# EAGLE design telemetry-b1 (EAGLE 7.6.0)
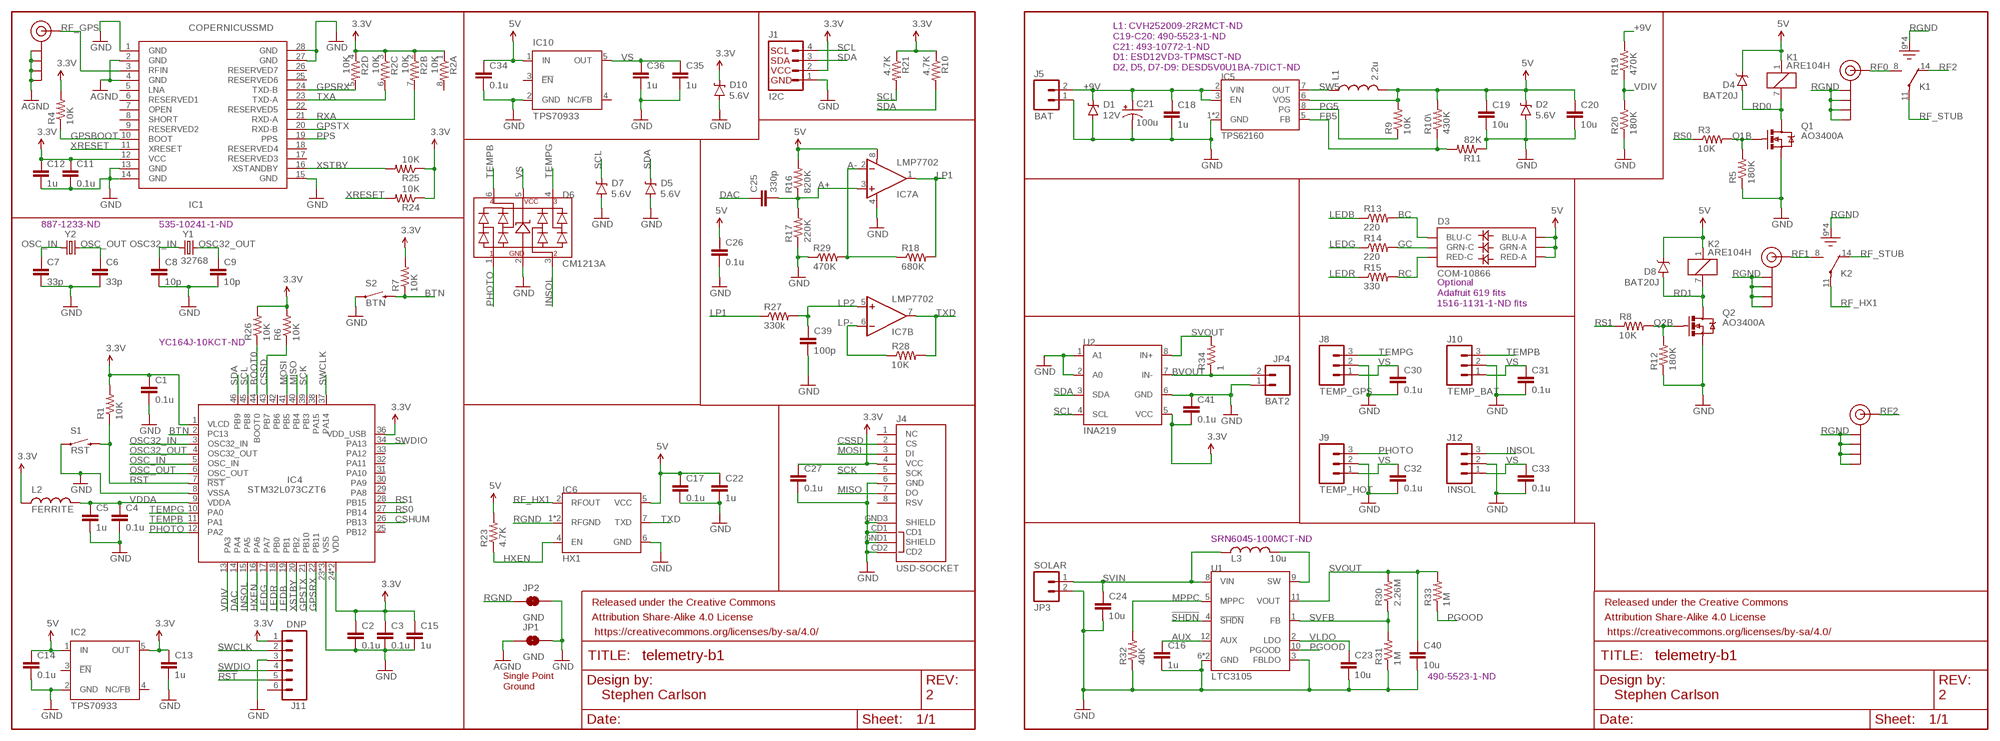
[diagram p0: schematic, sheet 1]

## Parts
C1  0.1u  CAP0805  [0805]
C2  0.1u  CAP0805  [0805]
C3  0.1u  CAP0805  [0805]
C4  0.1u  CAP0805  [0805]
C5  1u  CAP0805  [0805]
C6  33p  CAP0805  [0805]
C7  33p  CAP0805  [0805]
C8  10p  CAP0805  [0805]
C9  10p  CAP0805  [0805]
C11  0.1u  CAP0805  [0805]
C12  1u  CAP0805  [0805]
C13  1u  CAP0805  [0805]
C14  0.1u  CAP0805  [0805]
C15  1u  CAP0805  [0805]
C16  1u  CAP0805  [0805]
C17  0.1u  CAP0805  [0805]
C18  1u  CAP0805  [0805]
C19  10u  CAP0805  [0805]
C20  10u  CAP0805  [0805]
C21  100u  CAP_POLPTH2  [CPOL-RADIAL-10UF-25V]
C22  1u  CAP0805  [0805]
C23  10u  CAP0805  [0805]
C24  10u  CAP0805  [0805]
C25  330p  CAP0805  [0805]
C26  0.1u  CAP0805  [0805]
C27  0.1u  CAP0805  [0805]
C30  0.1u  CAP0805  [0805]
C31  0.1u  CAP0805  [0805]
C32  0.1u  CAP0805  [0805]
C33  0.1u  CAP0805  [0805]
C34  0.1u  CAP0805  [0805]
C35  1u  CAP0805  [0805]
C36  1u  CAP0805  [0805]
C39  100p  CAP0805  [0805]
C40  10u  CAP0805  [0805]
C41  0.1u  CAP0805  [0805]
D1  12V  DIODE-ZENER5.6V  [SOD-323]
D2  5.6V  DIODE-ZENER5.6V  [SOD-323]
D3  COM-10866  LED-TRICOLOR-5050NO_IC  [LED-TRICOLOR-5050]
D4  BAT20J  DIODE-SCHOTTKY-BAT20J  [SOD-323]
D5  5.6V  DIODE-ZENER5.6V  [SOD-323]
D6  CM1213A  [SC70-6L]
D7  5.6V  DIODE-ZENER5.6V  [SOD-323]
D8  BAT20J  DIODE-SCHOTTKY-BAT20J  [SOD-323]
D10  5.6V  DIODE-ZENER5.6V  [SOD-323]
FRAME1  FRAME-LETTERNO_PACKAGE  [DUMMY]
FRAME2  FRAME-LETTERNO_PACKAGE  [DUMMY]
IC1  COPERNICUSSMD  [COPERNICUS]
IC2  TPS70933  TPS77033  [SOT23-DBV]
IC4  STM32L073CZT6  STM32L07C  [TQFP48]
IC5  TPS62160  [MSOP8]
IC6  HX1  [HX1]
IC7  LMP7702  OPAMP-DUALU  [SO08]
IC10  TPS70933  TPS77033  [SOT23-DBV]
J1  I2C  I2C_STANDARD_NO_SILK  [1X04_NO_SILK]
J3  SMA_EDGE  [SMA-EDGE]
J4  USD-SOCKET  [MICROSD_1:1]
J5  BAT  M02PTH  [1X02]
J6  SMA_EDGE  [SMA-EDGE]
J7  SMA_EDGE  [SMA-EDGE]
J8  TEMP_GPS  M03JST-PTH  [JST-3-PTH]
J9  TEMP_HOT  M03JST-PTH  [JST-3-PTH]
J10  TEMP_BAT  M03JST-PTH  [JST-3-PTH]
J11  DNP  M06LOCK  [1X06_LOCK]
J12  INSOL  M03JST-PTH  [JST-3-PTH]
J13  SMA_EDGE  [SMA-EDGE]
JP1  GND  JUMPER-PAD-2-NC_BY_TRACE  [PAD-JUMPER-2-NC_BY_TRACE_YES_SILK]
JP2  GND  JUMPER-PAD-2-NC_BY_TRACE  [PAD-JUMPER-2-NC_BY_TRACE_YES_SILK]
JP3  SOLAR  M02PTH  [1X02]
JP4  BAT2  M02PTH  [1X02]
K1  ARE104H  RF_RELAY  [RFDIL14]
K2  ARE104H  RF_RELAY  [RFDIL14]
L1  2.2u  INDUCTOR1008  [1008]
L2  FERRITE  INDUCTOR1206  [1206]
L3  10u  INDUCTORBOURNS_SRN6045  [SRN6045]
Q1  AO3400A  MOSFET-NCHANNELAO3404A  [SOT23-3]
Q2  AO3400A  MOSFET-NCHANNELAO3404A  [SOT23-3]
R1  10K  RESISTOR0805-RES  [0805]
R2  10K  RESISTOR-ARRAY0603-ARV  [0603-ARV]
R3  10K  RESISTOR0805-RES  [0805]
R4  10K  RESISTOR0805-RES  [0805]
R5  180K  RESISTOR0805-RES  [0805]
R6  10K  RESISTOR0805-RES  [0805]
R7  10K  RESISTOR0805-RES  [0805]
R8  10K  RESISTOR0805-RES  [0805]
R9  10K  RESISTOR0805-RES  [0805]
R10  4.7K  RESISTOR0805-RES  [0805]
R10\  430K  RESISTOR0805-RES  [0805]
R11  82K  RESISTOR0805-RES  [0805]
R12  180K  RESISTOR0805-RES  [0805]
R13  220  RESISTOR0805-RES  [0805]
R14  220  RESISTOR0805-RES  [0805]
R15  330  RESISTOR0805-RES  [0805]
R16  820K  RESISTOR0805-RES  [0805]
R17  220K  RESISTOR0805-RES  [0805]
R18  680K  RESISTOR0805-RES  [0805]
R19  470K  RESISTOR0805-RES  [0805]
R20  180K  RESISTOR0805-RES  [0805]
R21  4.7K  RESISTOR0805-RES  [0805]
R23  4.7K  RESISTOR0805-RES  [0805]
R24  10K  RESISTOR0805-RES  [0805]
R25  10K  RESISTOR0805-RES  [0805]
R26  10K  RESISTOR0805-RES  [0805]
R27  330k  RESISTOR0805-RES  [0805]
R28  10K  RESISTOR0805-RES  [0805]
R29  470K  RESISTOR0805-RES  [0805]
R30  2.26M  RESISTOR0805-RES  [0805]
R31  1M  RESISTOR0805-RES  [0805]
R32  40K  RESISTOR0805-RES  [0805]
R33  1M  RESISTOR0805-RES  [0805]
R34  1  RESISTOR0805-RES  [0805]
S1  RST  SWITCH  [TACTILE-PTH-THIN]
S2  BTN  SWITCH  [TACTILE-PTH-THIN]
U1  LTC3105  [MSOP12]
U2  INA219  [SO8]
Y1  32768  CRYSTAL  [ABS25]
Y2  8M  CRYSTALSMD  [HC49UP]

## Nets
3.3V: C1.1 C2.1 C3.1 C11.1 C12.1 C13.1 C15.1 C27.1 C41.2 D10.C IC1.12(VCC) IC2.5(OUT) IC4.1(VLCD) IC4.24(VDD) IC4.36(VDD_USB) IC4.48(VDD) J1.2 J4.4(VCC) J11.1 L2.1 R1.2 R2.1 R2.2 R2.3 R2.4 R4.2 R6.2 R7.2 R10.1 R21.1 R24.1 R25.1 R26.2 U2.5(VCC)
5V: C14.1 C17.1 C19.1 C20.1 C22.1 C26.1 C34.1 D2.C D3.1(GRN-A) D3.2(RED-A) D3.3(BLU-A) D4.C D8.C IC2.1(IN) IC5.6(VOS) IC6.5(VCC) IC7.8(A:V+) IC10.1(IN) K1.1 K2.1 L1.2 R9.2 R10\.2 R16.2 R23.2
!RST!: IC4.7(!RST!) J11.5 R1.1 S1.2
!SHDN!: U1.4(!SHDN!)
+9V: C18.1 C21.1(+) D1.C IC5.2(VIN) IC5.3(EN) J5.2 R19.2
A+: C25.2 IC7.3(A:+IN) R16.1 R17.2
A-: IC7.2(A:-IN) R18.1 R29.2
AGND: IC1.2(GND) IC1.4(GND) J7.GND@0(GND) J7.GND@1(GND) J7.GND@2(GND) J7.GND@3(GND) JP1.1
AUX: C16.1 U1.12(AUX)
BC: D3.4(BLU-C) R13.2
BOOT0: IC4.44(BOOT0) R26.1
BTN: IC4.2(PC13) R7.1 S2.2
BVOUT: JP4.2 R34.1 U2.7(IN-)
CSHUM: IC4.26(PB13)
CSSD: IC4.43(PB7) J4.2(CS) R6.1
DAC: C25.1 IC4.14(PA4)
FB5: IC5.5(FB) R10\.1 R11.2
GC: D3.6(GRN-C) R14.2
GND: C1.2 C2.2 C3.2 C4.2 C5.2 C6.2 C7.2 C8.2 C9.2 C11.2 C12.2 C13.2 C14.2 C15.2 C16.2 C17.2 C18.2 C19.2 C20.2 C21.2(-) C22.2 C23.2 C24.2 C26.2 C27.2 C30.2 C31.2 C32.2 C33.2 C34.2 C35.2 C36.2 C39.2 C40.2 C41.1 D1.A D2.A D5.A D6.2(GND) D7.A D10.A IC1.1(GND) IC1.13(GND) IC1.14(GND) IC1.15(GND) IC1.27(GND) IC1.28(GND) IC2.2(GND) IC4.8(VSSA) IC4.23(VSS) IC4.35(VSS) IC4.47(VSS) IC5.1(GND) IC5.4(GND) IC6.6(GND) IC7.4(A:V-) IC10.2(GND) J1.1 J4.6(GND) J4.CD1 J4.CD2 J4.GND1(SHIELD) J4.GND3(SHIELD) J5.1 J8.2 J9.2 J10.2 J11.3 J12.2 JP1.2 JP2.2 JP3.2 JP4.1 Q1.2(S) Q2.2(S) R5.1 R11.1 R12.1 R17.1 R20.1 R29.1 R31.1 R32.1 S1.1 S2.1 U1.3(FBLDO) U1.6(GND) U1.7(GND) U2.1(A1) U2.2(A0) U2.6(GND)
GPSBOOT: IC1.10(BOOT) R4.1
GPSRX: IC1.24(TXD-B) IC4.22(PB11) R2.5
GPSTX: IC1.20(RXD-B) IC4.21(PB10)
HXEN: IC4.16(PA6) IC6.4(EN) R23.1
INSOL: D6.3(CH2) IC4.15(PA5) J12.3
LEDB: IC4.19(PB1) R13.1
LEDG: IC4.17(PA7) R14.1
LEDR: IC4.18(PB0) R15.1
LP1: IC7.1(A:OUT) R18.2 R27.1
LP2: C39.1 IC7.5(B:+IN) R27.2
LP-: IC7.6(B:-IN) R28.1
MISO: IC4.40(PB4) J4.7(DO)
MOSI: IC4.41(PB5) J4.3(DI)
MPPC: R32.2 U1.5(MPPC)
OSC32_IN: C8.1 IC4.3(OSC32_IN) Y1.1
OSC32_OUT: C9.1 IC4.4(OSC32_OUT) Y1.4
OSC_IN: C7.1 IC4.5(OSC_IN) Y2.1
OSC_OUT: C6.1 IC4.6(OSC_OUT) Y2.2
PG5: IC5.8(PG) R9.1
PGOOD: R33.1 U1.10(PGOOD)
PHOTO: D6.1(CH1) IC4.12(PA2) J9.3
PPS: IC1.19(PPS)
Q1B: Q1.1(G) R3.2 R5.2
Q2B: Q2.1(G) R8.2 R12.2
RC: D3.5(RED-C) R15.2
RD0: D4.A K1.7 Q1.3(D)
RD1: D8.A K2.7 Q2.3(D)
RF0: J6.SIG(SIGNAL) K1.8(S)
RF1: J3.SIG(SIGNAL) K2.8(S)
RF2: J13.SIG(SIGNAL) K1.14(O)
RF_GPS: IC1.3(RFIN) J7.SIG(SIGNAL)
RF_HX1: IC6.2(RFOUT) K2.11(P)
RF_STUB: K1.11(P) K2.14(O)
RGND: IC6.1(RFGND) IC6.3(RFGND) J3.GND@0(GND) J3.GND@1(GND) J3.GND@2(GND) J3.GND@3(GND) J6.GND@0(GND) J6.GND@1(GND) J6.GND@2(GND) J6.GND@3(GND) J13.GND@0(GND) J13.GND@1(GND) J13.GND@2(GND) J13.GND@3(GND) JP2.1 K1.9(GND) K1.10(GND) K1.12(GND) K1.13(GND) K2.9(GND) K2.10(GND) K2.12(GND) K2.13(GND)
RS0: IC4.27(PB14) R3.1
RS1: IC4.28(PB15) R8.1
RXA: IC1.21(RXD-A) R2.7
SCK: IC4.39(PB3) J4.5(SCK)
SCL: D7.C IC4.45(PB8) J1.4 R21.2 U2.4(SCL)
SDA: D5.C IC4.46(PB9) J1.3 R10.2 U2.3(SDA)
SVFB: R30.1 R31.2 U1.1(FB)
SVIN: C24.1 JP3.1 L3.1 U1.8(VIN)
SVOUT: C40.1 R30.2 R33.2 R34.2 U1.11(VOUT) U2.8(IN+)
SW: L3.2 U1.9(SW)
SW5: IC5.7(OUT) L1.1
SWCLK: IC4.37(PA14) J11.2
SWDIO: IC4.34(PA13) J11.4
TEMPB: D6.6(CH4) IC4.11(PA1) J10.3
TEMPG: D6.4(CH3) IC4.10(PA0) J8.3
TXA: IC1.23(TXD-A) R2.6
TXD: IC6.7(TXD) IC7.7(B:OUT) R28.2
VDDA: C4.1 C5.1 IC4.9(VDDA) L2.2
VDIV: IC4.13(PA3) R19.1 R20.2
VLDO: C23.1 U1.2(LDO)
VS: C30.1 C31.1 C32.1 C33.1 C35.1 C36.1 D6.5(VCC) IC10.5(OUT) J8.1 J9.1 J10.1 J12.1
XRESET: IC1.11(XRESET) R24.2
XSTBY: IC1.16(XSTANDBY) IC4.20(PB2) R25.2
Unconnected: IC1.5(LNA) IC1.6(RESERVED1) IC1.7(OPEN) IC1.8(SHORT) IC1.9(RESERVED2) IC1.17(RESERVED3) IC1.18(RESERVED4) IC1.22(RESERVED5) IC1.25(RESERVED6) IC1.26(RESERVED7) IC2.3(!EN) IC2.4(NC/FB) IC4.25(PB12) IC4.29(PA8) IC4.30(PA9) IC4.31(PA10) IC4.32(PA11) IC4.33(PA12) IC4.38(PA15) IC4.42(PB6) IC10.3(!EN) IC10.4(NC/FB) J4.1(NC) J4.8(RSV) J11.6 R2.8

## Notes on the sheet
- L1: CVH252009-2R2MCT-ND
  C19-C20: 490-5523-1-ND
  C21: 493-10772-1-ND
  D1: ESD12VD3-TPMSCT-ND
  D2, D5, D7-D9: DESD5V0U1BA-7DICT-ND
- 887-1233-ND | 535-10241-1-ND
- Optional
  Adafruit 619 fits
  1516-1131-1-ND fits
- YC164J-10KCT-ND
- SRN6045-100MCT-ND
- 490-5523-1-ND
- Single Point
  Ground
- Stephen Carlson | 2 | Stephen Carlson | 2

## Library data of the parts
C1-C9 C11-C20 C22-C27 C30-C36 C39-C41 = SparkFun-Passives:CAP: Capacitor Standard 0603 ceramic capacitor, and 0.1" leaded capacitor.
C21 = SparkFun-Passives:CAP_POL: Capacitor Polarized These are standard SMD and PTH capacitors. Normally 10uF, 47uF, and 100uF in electrolytic and tantalum varieties. Always verify the external diameter of the through hole cap, it varies with capacity, voltage, and manufacturer. The EIA devices should be standard.
D1 = SparkFun-DiscreteSemi:DIODE-ZENER: Zener Diode Production Part - 8199 3.4V Zener Voltage; PROD_ID: DIO-12442; VALUE: 5.6V
D2 D5 D7 D10 = SparkFun-DiscreteSemi:DIODE-ZENER: Zener Diode Production Part - 8199 3.4V Zener Voltage; PROD_ID: DIO-12442
D3 = SparkFun-LED:LED-TRICOLOR-5050
D4 D8 = SparkFun-DiscreteSemi:DIODE-SCHOTTKY: Schottky diodes in SFE's production catalog BAT20J 1A 23V 0.62Vf RB751 120mA 40V 0.37Vf PMEG4005EJ 0.5A 40V 0.42Vf MBRA140 1A 40V 0.5Vf B340A 3A 40V SMA; PROD_ID: DIO-11623
D6 = HAB:CM1213A: CM1213A CM1213A 4-channel ESD protection device
FRAME1 FRAME2 = SparkFun-Aesthetics:FRAME-LETTER: Schematic Frame Standard 8.5x11 US Letter frame; DESIGNER: Nobody; VERSION: v01
IC1 = SparkFun-RF:COPERNICUS: Copernicus II GPS- Trimble recommended layout and paste layer. Footprint production proven. Spark Fun Electronics SKU : GPS-07951
IC2 IC10 = texas:TPS770*: ULTRALOW-POWER 50-mA LOW-DROPOUT LINEAR REGULATORS 50-mA Low-Dropout Regulator Source: http://focus.ti.com/lit/ds/symlink/tps77001.pdf; MF: TEXAS INSTRUMENTS; MPN: TPS77033DBVT; OC_FARNELL: 8461570; OC_NEWARK: 77C1187
IC4 = stm32xx:STM32L07*C: STM32L07XC STM32L07X series in LQFP-48 package
IC5 = HAB:TPS62160: TPS62160 Adjustable switch-mode D-CAP2 regulator
IC6 = HAB:HX1: Radiometrix HX1 High-power VHF Narrow Band 300 mW Transmitter
IC7 = SparkFun-AnalogIC:OPAMP-DUAL: Generic op-amp footprint
J1 = SparkFun-Connectors:I2C_STANDARD: SparkFun has standardized on a pinout for all I2C based sensor breakouts. This pinout allows I2C boards to be plugged directly into the headers on Arduino Uno compatible boards, and to be daisy chained easily.
J3 J6 J7 J13 = SparkFun-Connectors:SMA_EDGE: SMA Antenna Connector End launch SMA connector. The paste layer has been removed so that the connector can be hand soldered onto the board after reflow.
J4 = SparkFun-Connectors:USD-SOCKET: microSD Socket Push-push type uSD socket. Schematic element and footprint production proven. Spark Fun Electronics SKU : PRT-00127. tDoc lines correctly indicate media card edge positions when inserting (unlocked, locked, depressed). NOTE: CD1 and CD2 are connected internally; PROD_ID: CONN-07820
J5 JP3 JP4 = SparkFun-Connectors:M02: Standard 2-pin 0.1" header. Use with - straight break away headers ( PRT-00116) - right angle break away headers (PRT-00553) - swiss pins (PRT-00743) - machine pins (PRT-00117) - female headers (PRT-00115) Molex polarized connector foot print use with: PRT-08233 with associated crimp pins and housings. 2.54_SCREWTERM for use with PRT-10571. 3.5mm Screw Terminal footprints for PRT-08084 5mm Screw Terminal footprints for use with PRT-08432
J8-J10 J12 = SparkFun-Connectors:M03: Header 3 Standard 3-pin 0.1" header. Use with straight break away headers (SKU : PRT-00116), right angle break away headers (PRT-00553), swiss pins (PRT-00743), machine pins (PRT-00117), and female headers (PRT-00115). Molex polarized connector foot print use with SKU : PRT-08232 with associated crimp pins and housings.; SKU: PRT-09915
J11 = SparkFun-Connectors:M06: Header 6 Standard 6-pin 0.1" header. Use with straight break away headers (SKU : PRT-00116), right angle break away headers (PRT-00553), swiss pins (PRT-00743), machine pins (PRT-00117), and female headers (PRT-00115). Molex polarized connector foot print use with SKU : PRT-08094 with associated crimp pins and housings. NOTES ON THE VARIANTS LOCK and LOCK_LONGPADS... This footprint was designed to help hold the alignment of a through-hole component (i.e. 6-pin header) while soldering it into place. You may notice that each hole has been shifted either up or down by 0.005 of an inch from it's more standard position (which is a perfectly straight line). This slight alteration caused the pins (the squares in the middle) to touch the edges of the holes. Because they are alternating, it causes a "brace" to hold the component in place. 0.005 has proven to be the perfect amount of "off-center" position when using our standard breakaway headers. Although looks a little odd when you look at the bare footprint, once you have a header in there, the alteration is very hard to notice. Also,if you push a header all the way into place, it is covered up entirely on the bottom side. This idea of altering the position of holes to aid alignment will be further integrated into the Sparkfun Library for other footprints. It can help hold any component with 3 or more connection pins.
JP1 JP2 = SparkFun-Passives:JUMPER-PAD-2-NC_BY_TRACE
K1 K2 = HAB:RF_RELAY: RF Relay RF Relay, Panasonic ARE10xx/ARE13xx series
L1 L2 = HAB:INDUCTOR: INDUCTOR Standard inductor, with some new packages Why do inductors never come in standard packages!?
L3 = SparkFun-Passives:INDUCTOR: Inductors Basic Inductor/Choke - 0603 and 1206. Footprints are not proven and vary greatly between part numbers. INDUCTOR POWER 3.3UH 4.0A SMD 0.197" L x 0.197" W x 0.177" H (5.00mm x 5.00mm x 4.50mm); PROD_ID: NDUC-11627; VALUE: 33uH
Q1 Q2 = SparkFun-DiscreteSemi:MOSFET-NCHANNEL: Common NMOSFET Parts MFG P/N Store ID Prod ID FDD8780 TRANS-09984 SI7820DN TRANS-11055 FDS6630A IC-08089 2N7002PW TRANS-11151 FQP30N06L COM-10213 TRANS-10060 BSS123LT1G TRANS-08345 BSS138 TRANS-00830 BS170 2N7000; PROD_ID: TRAN-12988
R1 R3-R10 R10\ R11-R21 R23-R34 = SparkFun-Passives:RESISTOR: Resistor Basic schematic elements and footprints for 0603, 1206, and PTH resistors.
R2 = SparkFun-Passives:RESISTOR-ARRAY: Array Chip Resistor Source: RS Component / Phycomp
S1 S2 = HAB:SWITCH: SWITCH Package for the MJTP1250, a thinner and lighter PTH push button switch.
U1 = LTC3105:LTC3105: LTC3105 400mA Step-Up DC/DC Converter with Maximum Power Point Control and 250mV Start-Up
U2 = HAB:INA219: INA219 26-V, Bi-Directional, Zero-Drift, High-Side, I2C Out Current/Power Monitor
Y1 = HAB:CRYSTAL: CRYSTAL Crystal oscillators in packages not in SparkFun-FreqCtl
Y2 = SparkFun-FreqCtrl:CRYSTAL: Various standard crystals. Proven footprints.

## Board
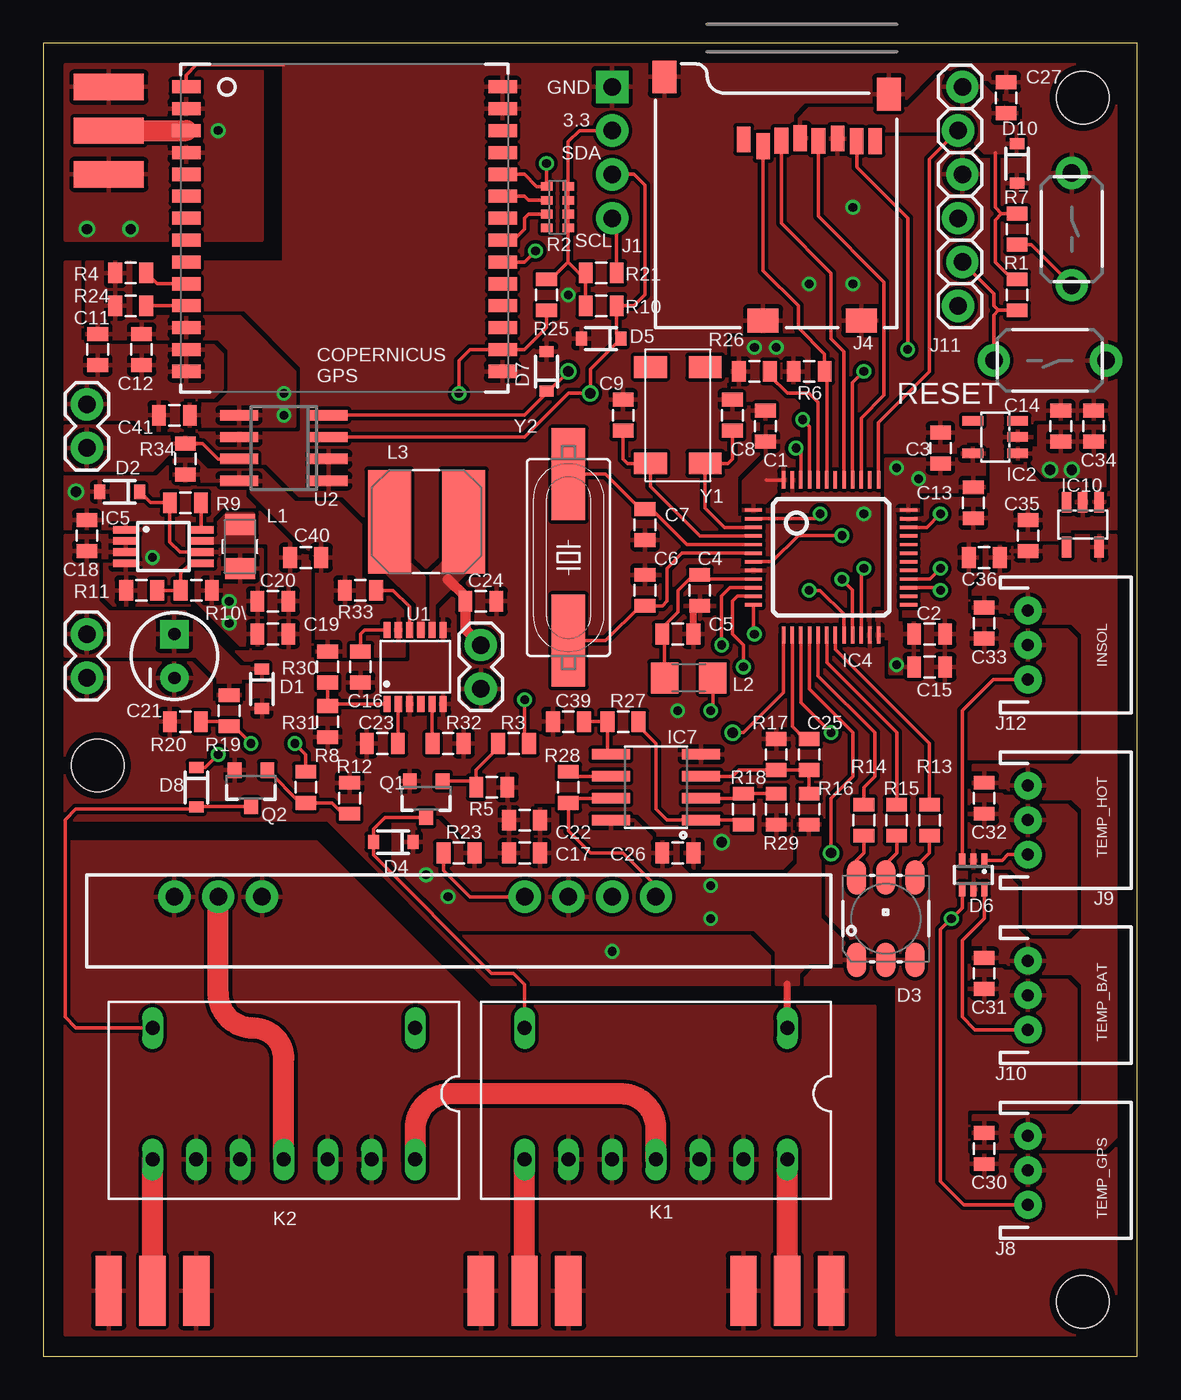
[diagram p1: board, top side]
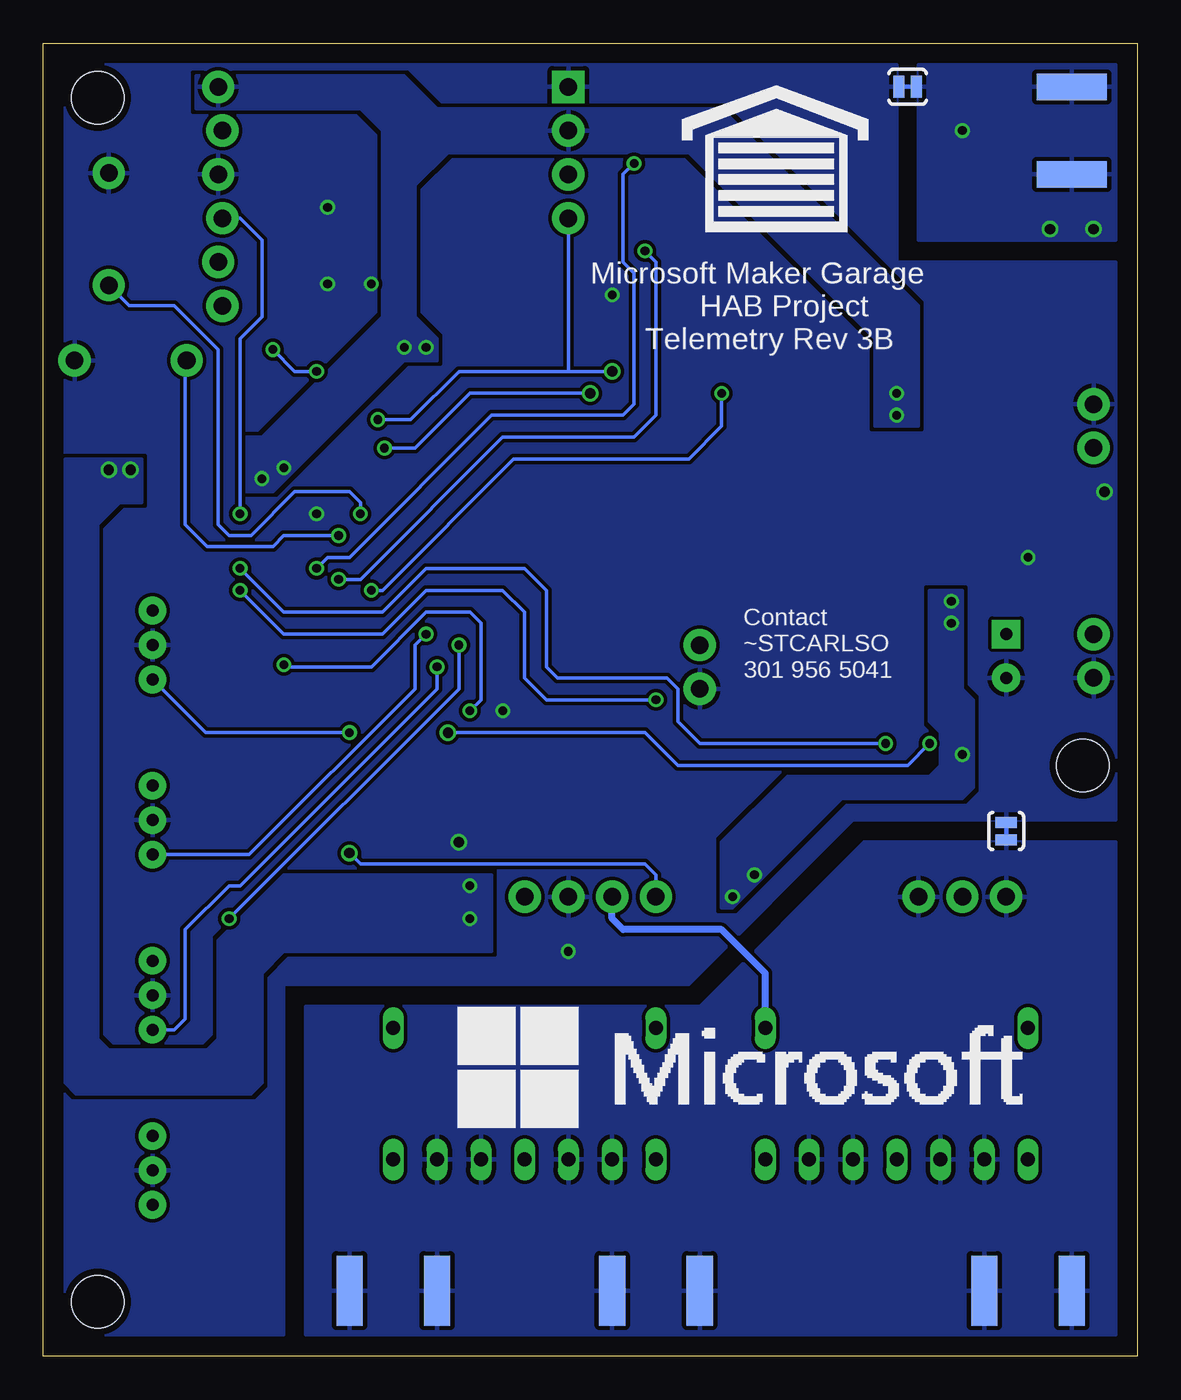
[diagram p2: board, bottom side, seen from below]

Size 63.5 x 76.2 mm. Coordinates in mm from the lower left corner, seen from the top.
Outline: 0,0 63.5,0 63.5,76.2 0,76.2 0,0
Copper layers (1*16): Top 0.0356mm / dielectric 1.5011mm / Bottom 0.0356mm
Design rules "LaenPCBOrder *": minimum track width 6mil, minimum drill 13mil, track to track 6mil, track to pad 6mil, pad to pad 6mil, via to via 6mil, smd to smd 6mil, copper to edge 15mil, drill to drill 6mil, minimum pad ring 7mil, minimum via ring 7mil, stop-mask expansion 3mil, vias tented up to drill 0mil, thermal gap 10mil
Holes 3.05 mm at 60.33,3.17 60.33,73.03 3.17,34.29

### Footprints (pad centres in the part's own frame; a part is rotated, then mirrored left to right if it is on the bottom)
0805 = smd 0.8 x 1.2: 1 -0.9,0; 2 0.9,0
CPOL-RADIAL-10UF-25V = drill 0.7 pad 1.651 square: 1 1.27,0 | drill 0.7 pad 1.651: 2 -1.27,0
SOD-323 = smd 0.63 x 0.83: A 1.15,0; C -1.15,0
LED-TRICOLOR-5050 = smd 2 x 1.1: 1 -2.4,1.7; 2 -2.4,0; 3 -2.4,-1.7; 4 2.4,-1.7; 5 2.4,0; 6 2.4,1.7
SC70-6L = smd 0.35 x 0.8: 1 -0.65,-0.85; 2 0,-0.85; 3 0.65,-0.85; 4 0.65,0.85; 5 0,0.85; 6 -0.65,0.85
COPERNICUS = smd 0.762 x 1.651: 1 0,-18.364; 2 1.27,-18.364; 3 2.54,-18.364; 4 3.81,-18.364; 5 5.08,-18.364; 6 6.35,-18.364; 7 7.62,-18.364; 8 8.89,-18.364; 9 10.16,-18.364; 10 11.43,-18.364; 11 12.7,-18.364; 12 13.97,-18.364; 13 15.24,-18.364; 14 16.51,-18.364; 15 16.51,0; 16 15.24,0; 17 13.97,0; 18 12.7,0; 19 11.43,0; 20 10.16,0; 21 8.89,0; 22 7.62,0; 23 6.35,0; 24 5.08,0; 25 3.81,0; 26 2.54,0; 27 1.27,0; 28 0,0
SOT23-DBV = smd 0.55 x 1.2: 1 -0.95,-1.3; 2 0,-1.3; 3 0.95,-1.3; 4 0.95,1.3; 5 -0.95,1.3
TQFP48 = smd 0.2 x 1: 1 -2.75,-4.5; 2 -2.25,-4.5; 3 -1.75,-4.5; 4 -1.25,-4.5; 5 -0.75,-4.5; 6 -0.25,-4.5; 7 0.25,-4.5; 8 0.75,-4.5; 9 1.25,-4.5; 10 1.75,-4.5; 11 2.25,-4.5; 12 2.75,-4.5; 25 2.75,4.5; 26 2.25,4.5; 27 1.75,4.5; 28 1.25,4.5; 29 0.75,4.5; 30 0.25,4.5; 31 -0.25,4.5; 32 -0.75,4.5; 33 -1.25,4.5; 34 -1.75,4.5; 35 -2.25,4.5; 36 -2.75,4.5 | smd 1 x 0.2: 13 4.5,-2.75; 14 4.5,-2.25; 15 4.5,-1.75; 16 4.5,-1.25; 17 4.5,-0.75; 18 4.5,-0.25; 19 4.5,0.25; 20 4.5,0.75; 21 4.5,1.25; 22 4.5,1.75; 23 4.5,2.25; 24 4.5,2.75; 37 -4.5,2.75; 38 -4.5,2.25; 39 -4.5,1.75; 40 -4.5,1.25; 41 -4.5,0.75; 42 -4.5,0.25; 43 -4.5,-0.25; 44 -4.5,-0.75; 45 -4.5,-1.25; 46 -4.5,-1.75; 47 -4.5,-2.25; 48 -4.5,-2.75
MSOP8 = smd 0.45 x 1.45: 1 -0.975,-2.2; 2 -0.325,-2.2; 3 0.325,-2.2; 4 0.975,-2.2; 5 0.975,2.2; 6 0.325,2.2; 7 -0.325,2.2; 8 -0.975,2.2
HX1 = drill 1.016 pad 1.88: 1 0,0; 2 2.54,0; 3 5.08,0; 4 20.32,0; 5 22.86,0; 6 25.4,0; 7 27.94,0
SO08 = smd 0.61 x 2.21: 1 -1.905,-2.616; 2 -0.635,-2.616; 3 0.635,-2.616; 4 1.905,-2.616; 5 1.905,2.616; 6 0.635,2.616; 7 -0.635,2.616; 8 -1.905,2.616
1X04_NO_SILK = drill 1.016 pad 1.88 square: 1 0,0 | drill 1.016 pad 1.88: 2 2.54,0; 3 5.08,0; 4 7.62,0
SMA-EDGE = smd 1.524 x 4.064: GND@0 0,0; GND@1 5.08,0; SIG 2.54,0 | smd 1.524 x 4.064 bottom: GND@2 0,0; GND@3 5.08,0
MICROSD_1:1 = smd 0.8 x 1.5: 1 5.096,10.919; 2 6.218,10.519; 3 7.274,10.853; 4 8.367,10.982; 5 9.421,10.828; 6 10.539,10.973; 7 11.648,10.819; 8 12.721,10.819 | smd 1.8 x 1.4: CD1 11.92,0.4; CD2 6.22,0.4 | smd 1.4 x 1.9: GND1 0.497,14.55; GND3 13.52,13.55
1X02 = drill 1.016 pad 1.88: 1 0,0; 2 2.54,0
JST-3-PTH = drill 0.7 pad 1.6: 1 -2,0; 2 0,0; 3 2,0
1X06_LOCK = drill 1.016 pad 1.88: 1 0,0; 2 2.54,-0.254; 3 5.08,0; 4 7.62,-0.254; 5 10.16,0; 6 12.7,-0.254
PAD-JUMPER-2-NC_BY_TRACE_YES_SILK = smd 0.635 x 1.27: 1 -0.508,0; 2 0.508,0
RFDIL14 = drill 0.813 long: 1 -7.62,-3.81; 7 7.62,-3.81; 8 7.62,3.81; 9 5.08,3.81; 10 2.54,3.81; 11 0,3.81; 12 -2.54,3.81; 13 -5.08,3.81; 14 -7.62,3.81
1008 = smd 1.753 x 1.219: 1 0,1.27; 2 0,-1.27
1206 = smd 1.6 x 1.8: 1 -1.4,0; 2 1.4,0
SRN6045 = smd 2.5 x 6: 1 -2.175,-0.175; 2 2.125,-0.175
SOT23-3 = smd 0.8 x 0.9: 1 -0.95,-1; 2 0.95,-1; 3 0,1.1
0603-ARV = smd 0.5 x 0.65: 1 -1.2,-0.625; 2 -0.4,-0.625; 3 0.4,-0.625; 4 1.2,-0.625; 5 1.2,0.625; 6 0.4,0.625; 7 -0.4,0.625; 8 -1.2,0.625
TACTILE-PTH-THIN = drill 1.016 pad 1.88: 1 -3.251,0; 2 3.251,0
MSOP12 = smd 0.419 x 0.94: 1 -1.625,-2.146; 2 -0.975,-2.146; 3 -0.325,-2.146; 4 0.325,-2.146; 5 0.975,-2.146; 6 1.625,-2.146; 7 1.625,2.146; 8 0.975,2.146; 9 0.325,2.146; 10 -0.325,2.146; 11 -0.975,2.146; 12 -1.625,2.146
SO8 = smd 0.6 x 2.2: 1 -1.905,-2.6; 2 -0.635,-2.6; 3 0.635,-2.6; 4 1.905,-2.6; 5 1.905,2.6; 6 0.635,2.6; 7 -0.635,2.6; 8 -1.905,2.6
ABS25 = smd 1.27 x 1.905: 1 -2.794,-1.587; 2 2.794,-1.587; 3 2.794,1.587; 4 -2.794,1.587
HC49UP = smd 5.334 x 1.93: 1 -4.826,0; 2 4.826,0

### Placement (x,y rotation side)
C1  41.91,53.98 90 top
C2  51.44,41.91 0 top
C3  52.07,52.7 90 top
C4  38.1,44.45 270 top
C5  36.83,41.91 0 top
C6  34.92,44.45 90 top
C7  34.92,48.26 270 top
C8  40.01,54.61 90 top
C9  33.66,54.61 90 top
C11  3.17,58.42 270 top
C12  5.71,58.42 270 top
C13  53.98,49.53 270 top
C14  59.05,53.98 90 top
C15  51.44,40.01 0 top
C16  18.41,40.01 270 top
C17  27.94,29.21 180 top
C18  2.54,47.62 90 top
C19  13.34,41.91 0 top
C20  13.34,43.81 0 top
C21  7.62,40.64 90 top
C22  27.94,31.11 180 top
C23  19.68,35.56 180 top
C24  25.4,43.81 0 top
C25  44.45,34.92 270 top
C26  36.83,29.21 0 top
C27  55.88,73.03 90 top
C30  54.61,12.06 270 top
C31  54.61,22.23 270 top
C32  54.61,32.38 270 top
C33  54.61,42.55 270 top
C34  60.96,53.98 90 top
C35  57.15,47.62 90 top
C36  54.61,46.35 180 top
C39  30.48,36.83 180 top
C40  15.24,46.35 180 top
C41  7.62,54.61 0 top
D1  12.7,38.73 270 top
D2  4.45,50.16 180 top
D3  48.9,25.4 90 top
D4  20.32,29.84 180 top
D5  32.38,59.05 180 top
D6  53.98,27.94 180 top
D7  29.21,57.15 90 top
D8  8.89,33.02 270 top
D10  56.52,69.22 270 top
FRAME1  1.27,77.47 0 top
FRAME2  0,77.47 0 top
IC1  26.67,73.66 270 top
IC2  55.24,53.34 90 top
IC4  45.72,46.35 270 top
IC5  6.99,46.99 270 top
IC6  7.62,26.67 0 top
IC7  35.56,33.02 90 top
IC10  60.33,48.26 180 top
J1  33.02,73.66 270 top
J3  3.81,3.81 0 top
J4  35.56,59.69 0 top
J5  2.54,39.37 90 top
J6  25.4,3.81 0 top
J7  3.81,68.58 90 top
J8  57.15,10.79 270 top
J9  57.15,31.11 270 top
J10  57.15,20.95 270 top
J11  53.34,73.66 270 top
J12  57.15,41.27 270 top
J13  40.64,3.81 0 top
JP1  13.34,73.66 180 bottom
JP2  7.62,30.48 90 bottom
JP3  25.4,41.27 270 top
JP4  2.54,55.24 270 top
K1  35.56,15.24 180 top
K2  13.97,15.24 180 top
L1  11.43,46.99 0 top
L2  37.47,39.37 180 top
L3  22.23,48.26 180 top
Q1  22.23,32.38 180 top
Q2  12.06,33.02 180 top
R1  56.52,61.59 90 top
R2  29.84,66.67 90 top
R3  27.3,35.56 180 top
R4  5.08,62.87 180 top
R5  26.04,33.02 180 top
R6  44.45,57.15 180 top
R7  56.52,65.41 90 top
R8  15.24,33.02 270 top
R9  8.26,49.53 180 top
R10  32.38,60.96 0 top
R10\  8.89,44.45 0 top
R11  5.71,44.45 0 top
R12  17.78,32.38 270 top
R13  51.44,31.11 270 top
R14  47.62,31.11 270 top
R15  49.53,31.11 270 top
R16  44.45,31.75 270 top
R17  42.55,34.92 270 top
R18  40.64,31.75 270 top
R19  10.79,37.47 90 top
R20  8.26,36.83 0 top
R21  32.38,62.87 0 top
R23  24.13,29.21 0 top
R24  5.08,60.96 0 top
R25  29.21,61.59 270 top
R26  41.27,57.15 180 top
R27  33.66,36.83 180 top
R28  30.48,33.02 270 top
R29  42.55,31.75 90 top
R30  16.51,40.01 90 top
R31  16.51,36.83 90 top
R32  23.5,35.56 180 top
R33  18.41,44.45 180 top
R34  8.26,52.07 270 top
S1  58.42,57.78 180 top
S2  59.69,65.41 270 top
U1  21.59,40.01 0 top
U2  13.97,52.7 90 top
U$2  [GARAGE]  20.95,68.58 0 bottom
U$5  [MSFT_LOGO]  20.32,16.51 0 bottom
Y1  36.83,54.61 90 top
Y2  30.48,46.35 270 top

### Tracks (layer width: path | path; a pad name or v marks a point on that pad's centre or on a via)
3.3V  (via drill 0.5)
  Top 0.203: 50.16,49.16 IC4.36 | IC4.48 41.97,50.85 | R2.1 R2.2 R2.3 R2.4 30.47,70.47 31.11,71.12 J1.2 | R2.1 | R7.2 55.62,66.31 | 55.62,66.31 55.24,66.67 55.24,69.85 | R1.2 56.25,62.49 55.24,63.5 55.24,65.94 55.62,66.31 | R2.1 30.47,63.49 | R25.1 29.48,62.49 30.47,63.49 | L2.1 38.87,37.59 v38.73,37.47 | 30.47,63.49 31.09,62.87 R21.1 R10.1
  Bottom 0.203: v38.73,37.47 38.1,38.1 38.1,42.55 38.73,43.18 41.27,43.18 44.45,40.01 49.4,40.01 v49.53,40.13
  other vias: 41.27,58.55 13.97,54.61 13.97,55.88 42.55,58.55 49.53,51.56 50.8,50.93
  pour Top (isolate 0.203, rank 2): 53.34,52.7 53.34,52.07 48.9,52.07 48.9,43.18 48.39,43.18 48.39,41.66 49.15,41.66 49.15,39.62 50.8,39.62 50.8,42.55 49.53,42.55 49.53,49.02 50.8,49.02 50.8,50.16 54.61,50.16 54.61,52.7
  pour Top (isolate 0.203, rank 2): 40.64,48.9 41.27,48.9 43.81,51.44 43.81,55.24 43.18,55.88 43.18,56.52 44.45,56.52 44.45,59.05 40.01,59.05 40.01,55.5 42.55,55.5 42.55,53.98 41.91,53.98 41.91,52.07 40.64,50.8
  pour Top (isolate 0.203, rank 2): 14.61,53.98 8.26,53.98 8.26,55.24 10.16,55.24 10.79,55.88 10.79,58.42 10.16,59.05 2.54,59.05 2.54,63.5 5.08,63.5 5.08,60.33 11.43,60.33 14.61,57.15
  pour Top (isolate 0.203, rank 2): 43.81,71.75 43.81,70.48 44.45,70.48 44.45,71.12 53.34,71.12 54.61,69.85 56.52,69.85 56.52,72.39 55.88,72.39 53.98,74.3 52.07,74.3 50.16,72.39 44.45,72.39
  pour Bottom (isolate 0.203): 24.13,72.39 12.7,60.96 12.7,53.98 15.24,53.98 15.24,59.05 26.04,69.85 40.01,69.85 41.91,67.94 41.91,60.33 40.64,59.05 40.64,57.78 42.55,57.78 50.16,50.16 52.07,50.16 52.07,53.34 50.8,53.34 43.81,60.33 43.81,71.12 45.09,72.39 54.61,72.39 54.61,74.3 42.55,74.3 40.64,72.39
5V  (via drill 0.5, 0.6)
  Top 0.203: IC5.6 7.95,46.66 7.36,47.26 R9.2 6.23,49.53 D2.C | D8.C 9.4,34.17 v10.16,34.92
  Top 0.406: K1.1 43.18,21.59
  Bottom 0.406: K2.1 21.59,22.23 24.13,24.77 29.84,24.77 30.48,25.4 IC6.5
  other vias: 38.73,27.3 38.73,25.4 58.42,51.44 59.69,51.44 22.23,27.94 23.5,26.67 10.79,43.81 10.79,42.55
  pour Top (isolate 0.203): 8.89,46.81 8.89,43.81 11.43,41.27 12.7,41.27 12.7,46.81
  pour Top (isolate 0.203, rank 2): 57.78,53.98 57.78,52.7 56.52,52.7 56.52,52.07 57.15,52.07 58.17,51.05 60.96,51.05 60.96,49.53 61.59,49.53 61.59,53.98
  pour Top (isolate 0.203, rank 2): 28.57,31.75 28.57,28.57 25.4,28.57 22.23,31.75 20.32,31.75 20.32,28.57 24.13,24.77 41.27,24.77 42.55,23.5 42.55,21.59 43.81,21.59 43.81,22.23 44.45,22.86 50.8,22.86 50.8,23.5 46.99,23.5 45.09,25.4 45.09,31.11 43.81,31.11 43.81,28.57 43.18,27.94 37.47,27.94 36.83,28.57 36.83,29.84 35.56,29.84 34.29,31.11 32.38,31.11 32.38,30.48 29.84,30.48 29.84,31.75
  pour Bottom (isolate 0.203): 57.78,52.07 57.78,49.53 59.05,49.53 60.33,48.26 60.33,18.41 59.69,17.78 53.98,17.78 53.34,18.41 53.34,24.13 49.53,27.94 37.47,27.94 37.47,23.5 49.53,23.5 50.8,22.23 50.8,15.88 51.44,15.24 61.59,15.24 62.23,15.88 62.23,52.07
  pour Bottom: 10.16,44.45 10.16,38.73 9.53,38.1 9.53,33.02 10.16,32.38 17.14,32.38 23.5,26.04 24.13,26.04 24.13,29.84 20.32,33.66 12.06,33.66 11.43,34.29 11.43,36.2 12.06,36.83 12.06,44.45
!RST!  (via drill 0.5)
  Top 0.203: J11.5 55.17,61.67 55.17,60.96 55.43,60.7 | R1.1 55.43,60.7 | S1.2 55.17,60.43 55.43,60.7 | IC4.7 42.3,46.1 43.81,47.62 v46.35,47.62
  Bottom 0.203: v46.35,47.62 49.53,47.62 50.16,46.99 53.98,46.99 55.24,48.26 55.24,57.71 S1.2
+9V
  pour Top (isolate 0.203, rank 2): 1.27,40.64 8.89,40.64 10.16,39.37 10.16,38.1 11.43,38.1 11.43,39.37 12.7,39.37 12.7,40.01 11.43,40.01 8.26,43.18 3.81,43.18 3.17,43.81 3.17,46.35 5.08,46.35 5.08,47.62 1.27,47.62
A+
  Top 0.203: R16.1 C25.2 R17.2 40.38,34.02 40.01,33.66 IC7.3
A-
  Top 0.203: IC7.2 40.38,32.38 R18.1 R29.2
AGND  (via drill 0.5, 0.6)
  other vias: 10.16,71.12 5.08,65.41 2.54,65.41
  pour Bottom (isolate 0.203, rank 2): 1.27,74.93 1.27,64.77 12.7,64.77 12.7,74.93
  pour Top (isolate 0.203, rank 2): 1.27,74.93 1.27,64.77 12.7,64.77 12.7,74.93
AUX
  Top 0.203: U1.12 18.66,42.15 18.41,41.91 C16.1
BC
  Top 0.203: R13.2 51.44,29.21 50.59,28.37 D3.4
BOOT0
  Top 0.203: IC4.44 44.97,55.36 44.45,55.88 43.18,55.88 42.17,56.88 R26.1
BTN  (via drill 0.5)
  Top 0.203: IC4.2 44.8,48.6 v45.09,48.9 | R7.1 57.34,64.5 S2.2
  Bottom 0.203: v45.09,48.9 45.09,49.53 45.72,50.16 48.9,50.16 51.44,47.62 52.7,47.62 53.34,48.26 53.34,58.42 55.88,60.96 58.5,60.96 S2.2
BVOUT
  Top 0.203: U2.7 10.16,52.07 9.26,52.97 R34.1
  pour Top (isolate 0.203): 1.27,53.98 1.27,51.44 6.35,51.44 7.62,52.7 8.89,52.7 8.89,53.34 5.71,53.34 5.08,53.98
CSSD
  Top 0.203: IC4.43 45.47,57.03 R6.1 45.35,58.16 43.81,59.69 43.81,60.96 41.78,63 J4.2
DAC
  Top 0.203: IC4.14 43.47,36.54 44.19,35.83 C25.1
FB5
  Top 0.203: IC5.5 8.55,46.02 7.99,45.45 R10\.1 R11.2
GC
  Top 0.203: R14.2 47.62,29.21 47.2,28.78 D3.6
GND  (via drill 0.5, 0.6)
  Top 0.203: IC1.1 8.31,74.35 8.89,74.93 13.97,74.93
  Top 0.406: C5.2 37.73,43.18 C4.2
  other vias: 1.91,50.16 6.35,46.35 39.37,29.84 33.02,23.5 46.99,62.23 47.62,48.9 46.99,66.67 30.48,61.59 44.45,62.23 36.83,37.47
  pour Top (isolate 0.203, rank 3): 1.27,63.5 1.27,31.11 16.51,31.11 26.04,21.59 49.53,21.59 49.53,1.27 62.23,1.27 62.23,74.93 13.97,74.93 13.97,63.5
  pour Bottom (isolate 0.203, rank 3): 1.27,63.5 1.27,31.11 16.51,31.11 26.04,21.59 49.53,21.59 49.53,1.27 62.23,1.27 62.23,74.93 13.97,74.93 13.97,63.5
GPSBOOT
  Top 0.203: IC1.10 6.62,62.23 R4.1
GPSRX  (via drill 0.5)
  Top 0.203: IC1.24 27.94,68.58 28.64,67.88 R2.5 29.22,69.2 v29.21,69.22 | IC4.22 47.47,45.56 v47.62,45.72
  Bottom 0.203: v47.62,45.72 46.99,46.35 45.72,46.35 37.47,54.61 29.84,54.61 29.21,55.24 29.21,62.87 29.84,63.5 29.84,68.58 v29.21,69.22
GPSTX  (via drill 0.5)
  Top 0.203: IC4.21 46.97,44.47 v46.35,45.09 | IC1.20 27.94,63.5 v28.57,64.14
  Bottom 0.203: v46.35,45.09 45.09,45.09 36.83,53.34 29.21,53.34 27.94,54.61 27.94,63.5 v28.57,64.14
HXEN  (via drill 0.6)
  Top 0.203: v45.72,29.21 45.72,32.38 46.99,33.66 46.99,36.2 44.47,38.72 IC4.16 | R23.1 23.23,28.2 24.77,26.67 IC6.4
  Bottom 0.203: v45.72,29.21 45.09,28.57 28.57,28.57 27.94,27.94 IC6.4
INSOL  (via drill 0.5)
  Top 0.203: J12.3 55.15,39.27 53.34,37.47 53.34,28.8 D6.3 | IC4.15 43.97,37.95 v45.72,36.2
  Bottom 0.203: v45.72,36.2 54.07,36.2 J12.3
LEDB
  Top 0.203: R13.1 51.44,35.56 45.97,41.02 IC4.19
LEDG
  Top 0.203: IC4.17 44.97,39.48 48.26,36.2 48.26,33.66 47.62,33.02 R14.1
LEDR
  Top 0.203: R15.1 49.53,36.2 45.47,40.26 IC4.18
LP1
  Top 0.203: R18.2 40.38,31.11 IC7.1 36.2,31.11 35.56,31.75 35.56,35.56 34.55,36.56 R27.1
LP2
  Top 0.203: C39.1 R27.2 32.76,35.11 IC7.5
LP-
  Top 0.203: IC7.6 30.75,33.66 R28.1
MISO  (via drill 0.5)
  Top 0.203: IC4.40 46.97,56.49 v47.62,57.15 | J4.7 47.21,69 50.16,66.04 v50.16,58.42
  Bottom 0.203: v47.62,57.15 48.9,57.15 v50.16,58.42
MOSI
  Top 0.203: IC4.41 46.47,58.3 45.72,59.05 45.72,62.87 42.83,65.75 J4.3
MPPC
  Top 0.203: U1.5 22.57,35.59 R32.2
OSC32_IN
  Top 0.203: IC4.3 39.52,48.1 38.42,49.21 Y1.1 39.75,51.82 40.01,52.07 C8.1
OSC32_OUT
  Top 0.203: IC4.4 38.12,47.6 35.24,50.48 Y1.4 33.91,51.82 33.66,52.07 C9.1
OSC_IN
  Top 0.203: Y2.1 32.64,51.18 34.66,49.16 C7.1 35.3,49.16 37.35,47.1 IC4.5
OSC_OUT
  Top 0.203: Y2.2 32.64,41.53 34.66,43.55 C6.1 35.93,43.55 36.2,43.81 36.2,45.72 37.08,46.6 IC4.6
PG5
  Top 0.203: IC5.8 9.19,49.5 R9.1
PGOOD
  Top 0.203: U1.10 21.27,43.51 20.32,44.45 R33.1
PHOTO  (via drill 0.5)
  Top 0.203: J9.3 55.98,29.11 55.65,28.79 D6.1 | IC4.12 41.22,41.97 v41.27,41.91
  Bottom 0.203: v41.27,41.91 41.91,41.27 41.91,38.73 51.53,29.11 J9.3
Q1B
  Top 0.203: Q1.1 24.77,33.38 R5.2 25.14,34.02 26.41,35.3 R3.2
Q2B
  Top 0.203: 13.12,33.92 Q2.1 14.91,32.12 R8.2 16.77,32.12 17.41,31.48 R12.2
RC
  Top 0.203: R15.2 49.53,29.21 48.9,28.57 D3.5
RD0
  Top 0.203: K1.7 27.94,21.59 27.3,22.23 26.04,22.23 19.17,29.09 D4.A 19.17,30.6 19.86,31.29 Q1.3
RD1
  Top 0.203: K2.7 1.91,19.05 1.27,19.68 1.27,31.11 1.91,31.75 8.77,31.75 D8.A 8.94,31.92 Q2.3
RF0
  Top 1.232: J6.SIG K1.8
RF1
  Top 1.232: J3.SIG K2.8
RF2
  Top 1.232: J13.SIG K1.14
RF_GPS
  Top 1.232: J7.SIG IC1.3
RF_HX1
  Top 1.232: K2.11 13.97,17.27 arc90 12.19,19.05 arc-90 10.16,21.08 IC6.2
RF_STUB
  Top 1.232: K1.11 35.56,13.21 arc90 33.53,15.24 23.62,15.24 arc90 21.59,13.21 K2.14
RGND
  pour Top (isolate 0.203, rank 3): 1.27,29.84 1.27,1.27 48.26,1.27 48.26,20.32 25.4,20.32 15.88,29.84
  pour Bottom (isolate 0.203, rank 3): 1.27,1.27 1.27,29.84 15.88,29.84 25.4,20.32 48.26,20.32 48.26,1.27
RS0  (via drill 0.5)
  Top 0.203: IC4.27 51.91,44.6 v52.07,44.45 | v27.94,38.1 27.94,35.83 R3.1
  Bottom 0.203: v27.94,38.1 34.29,38.1 35.56,39.37 35.56,43.18 36.83,44.45 41.27,44.45 43.81,41.91 49.53,41.91 v52.07,44.45
RS1  (via drill 0.5)
  Top 0.203: IC4.28 51.45,45.1 v52.07,45.72 | R8.1 15.24,34.92 v14.61,35.56
  Bottom 0.203: v14.61,35.56 25.4,35.56 26.67,36.83 26.67,38.73 27.3,39.37 33.66,39.37 34.29,40.01 34.29,44.45 35.56,45.72 41.27,45.72 43.81,43.18 49.53,43.18 v52.07,45.72
RXA
  Top 0.203: R2.7 28.18,66.28 27.94,66.04 27.94,65.41 27.3,64.77 IC1.21
SCK
  Top 0.203: IC4.39 47.47,54.45 48.79,55.78 48.79,62.33 44.98,66.14 J4.5
SCL  (via drill 0.5, 0.6)
  Top 0.203: IC4.45 44.47,53.95 v44.07,54.36 | U2.4 27.94,54.61 29.21,55.88 D7.C 29.33,56 v30.48,57.15 | R21.2 33.28,65.78 J1.4
  Bottom 0.203: v30.48,57.15 33.02,57.15 | 33.02,57.15 39.37,57.15 42.16,54.36 v44.07,54.36 | J1.4 33.02,57.15
SDA  (via drill 0.5, 0.6)
  Top 0.203: U2.3 27.94,53.34 30.48,55.88 v31.75,55.88 31.75,57.27 D5.C 33.28,59.3 R10.2 34.29,60.96 34.92,61.59 34.92,67.94 34.29,68.58 J1.3 | IC4.46 43.97,52.42 v43.69,52.7
  Bottom 0.203: v31.75,55.88 38.73,55.88 41.91,52.7 v43.69,52.7
SVFB
  Top 0.203: U1.1 16.64,37.86 R31.2 R30.1
SVIN
  Top 0.61: 23.5,45.09 24.5,44.08 C24.1 24.5,42.17 JP3.1
  pour Top (isolate 0.203, rank 2, no thermals): 23.5,50.8 23.5,46.35 22.35,45.21 22.35,41.91 22.68,41.91 22.68,43.64 25.4,46.35 25.4,50.8
SVOUT
  pour Top (isolate 0.203, rank 2): 15.88,40.64 20.95,40.64 20.95,43.18 19.05,45.09 18.41,45.09 18.41,48.26 17.14,49.53 14.61,49.53 12.7,51.44 9.53,51.44 8.89,52.07 7.62,52.07 7.62,50.8 11.43,50.8 15.88,46.35
SW
  pour Top (isolate 0.203, no thermals): 22.1,41.91 22.1,45.21 20.95,46.35 20.95,50.8 19.05,50.8 19.05,45.72 19.68,45.72 21.72,43.69 21.72,41.91
SW5
  pour Top (isolate 0.203, rank 2, no thermals): 8.89,47.5 8.89,47.12 12.19,47.12 12.19,48.9 10.67,48.9 9.27,47.5
SWCLK
  Top 0.203: IC4.37 48.47,54.19 51.44,57.15 51.44,69.47 J11.2
SWDIO  (via drill 0.5)
  Top 0.203: IC4.34 51.28,48.1 v52.07,48.9
  Bottom 0.203: v52.07,48.9 52.07,59.05 50.8,60.33 50.8,64.77 52.07,66.04 J11.4
TEMPB  (via drill 0.5)
  Top 0.203: J10.3 54.07,18.95 53.34,19.68 53.34,24.13 54.61,25.4 54.61,27.07 D6.6 | IC4.11 40.3,44.1 40.01,43.81 40.01,41.91 40.64,41.27 v40.64,40.01
  Bottom 0.203: v40.64,40.01 40.64,38.73 52.07,27.3 52.7,27.3 55.24,24.77 55.24,19.59 55.88,18.95 J10.3
TEMPG  (via drill 0.5)
  Top 0.203: J8.3 53.44,8.79 52.07,10.16 52.07,24.77 v52.7,25.4 53.34,26.04 53.34,27.07 D6.4 | IC4.10 39.85,44.6 39.37,44.12 v39.37,41.27
  Bottom 0.203: v39.37,41.27 39.37,38.73 v52.7,25.4
TXA
  Top 0.203: R2.6 28.18,67.08 27.94,67.31 IC1.23
TXD
  Top 0.203: IC7.7 30.75,32.38 R28.2 30.48,30.48 31.75,29.21 33.66,29.21 35.56,27.3 IC6.7
VDDA
  Top 0.203: IC4.9 38.34,45.1 C4.1 37.73,45.35 36.83,44.45 36.83,43.18 35.93,42.28 C5.1 36.06,41.77 L2.2
VDIV  (via drill 0.5, 0.6)
  Top 0.203: R20.2 10.53,36.83 R19.1 11.06,36.56 v12.06,35.56 | IC4.13 42.97,38.52 40.64,36.2 v40.01,36.2
  Bottom 0.203: v40.01,36.2 28.57,36.2 26.67,34.29 13.34,34.29 v12.06,35.56
VLDO
  Top 0.203: C23.1 20.59,37.83 U1.2
VS
  pour Top (isolate 0.203, rank 2): 53.98,12.06 61.59,12.06 62.23,12.7 62.23,47.62 59.69,47.62 59.69,46.99 54.61,46.99 54.61,45.09 53.98,44.45 53.98,43.18 55.88,43.18 56.52,42.55 59.69,42.55 60.33,41.91 60.33,34.92 59.69,34.29 53.98,34.29 53.98,33.02 55.88,33.02 56.52,32.38 59.69,32.38 60.33,31.75 60.33,24.77 59.69,24.13 57.15,24.13 56.52,24.77 56.52,27.3 55.88,27.94 53.98,27.94 53.98,26.67 54.61,26.67 54.61,24.77 53.98,24.13 53.98,22.86 55.88,22.86 56.52,22.23 59.69,22.23 60.33,21.59 60.33,14.61 59.69,13.97 53.98,13.97
XRESET
  Top 0.203: IC1.11 R24.2
XSTBY  (via drill 0.5)
  Top 0.203: IC4.20 46.47,43.06 45.09,44.45 v44.45,44.45 | R25.2 29.21,59.69 27.94,58.42 IC1.16 24.77,58.42 24.13,57.78 v24.13,55.88
  Bottom 0.203: v44.45,44.45 43.81,44.45 36.2,52.07 26.04,52.07 24.13,53.98 v24.13,55.88

### Text on the board
tPlace: GND | 3.3 | SDA | SCL | COPERNICUS / GPS | RESET | Y1
bPlace: Microsoft Maker Garage | HAB Project | Telemetry Rev 3B | Contact / ~STCARLSO / 301 956 5041